# EAGLE design lsm330dl (EAGLE 7.3.0)
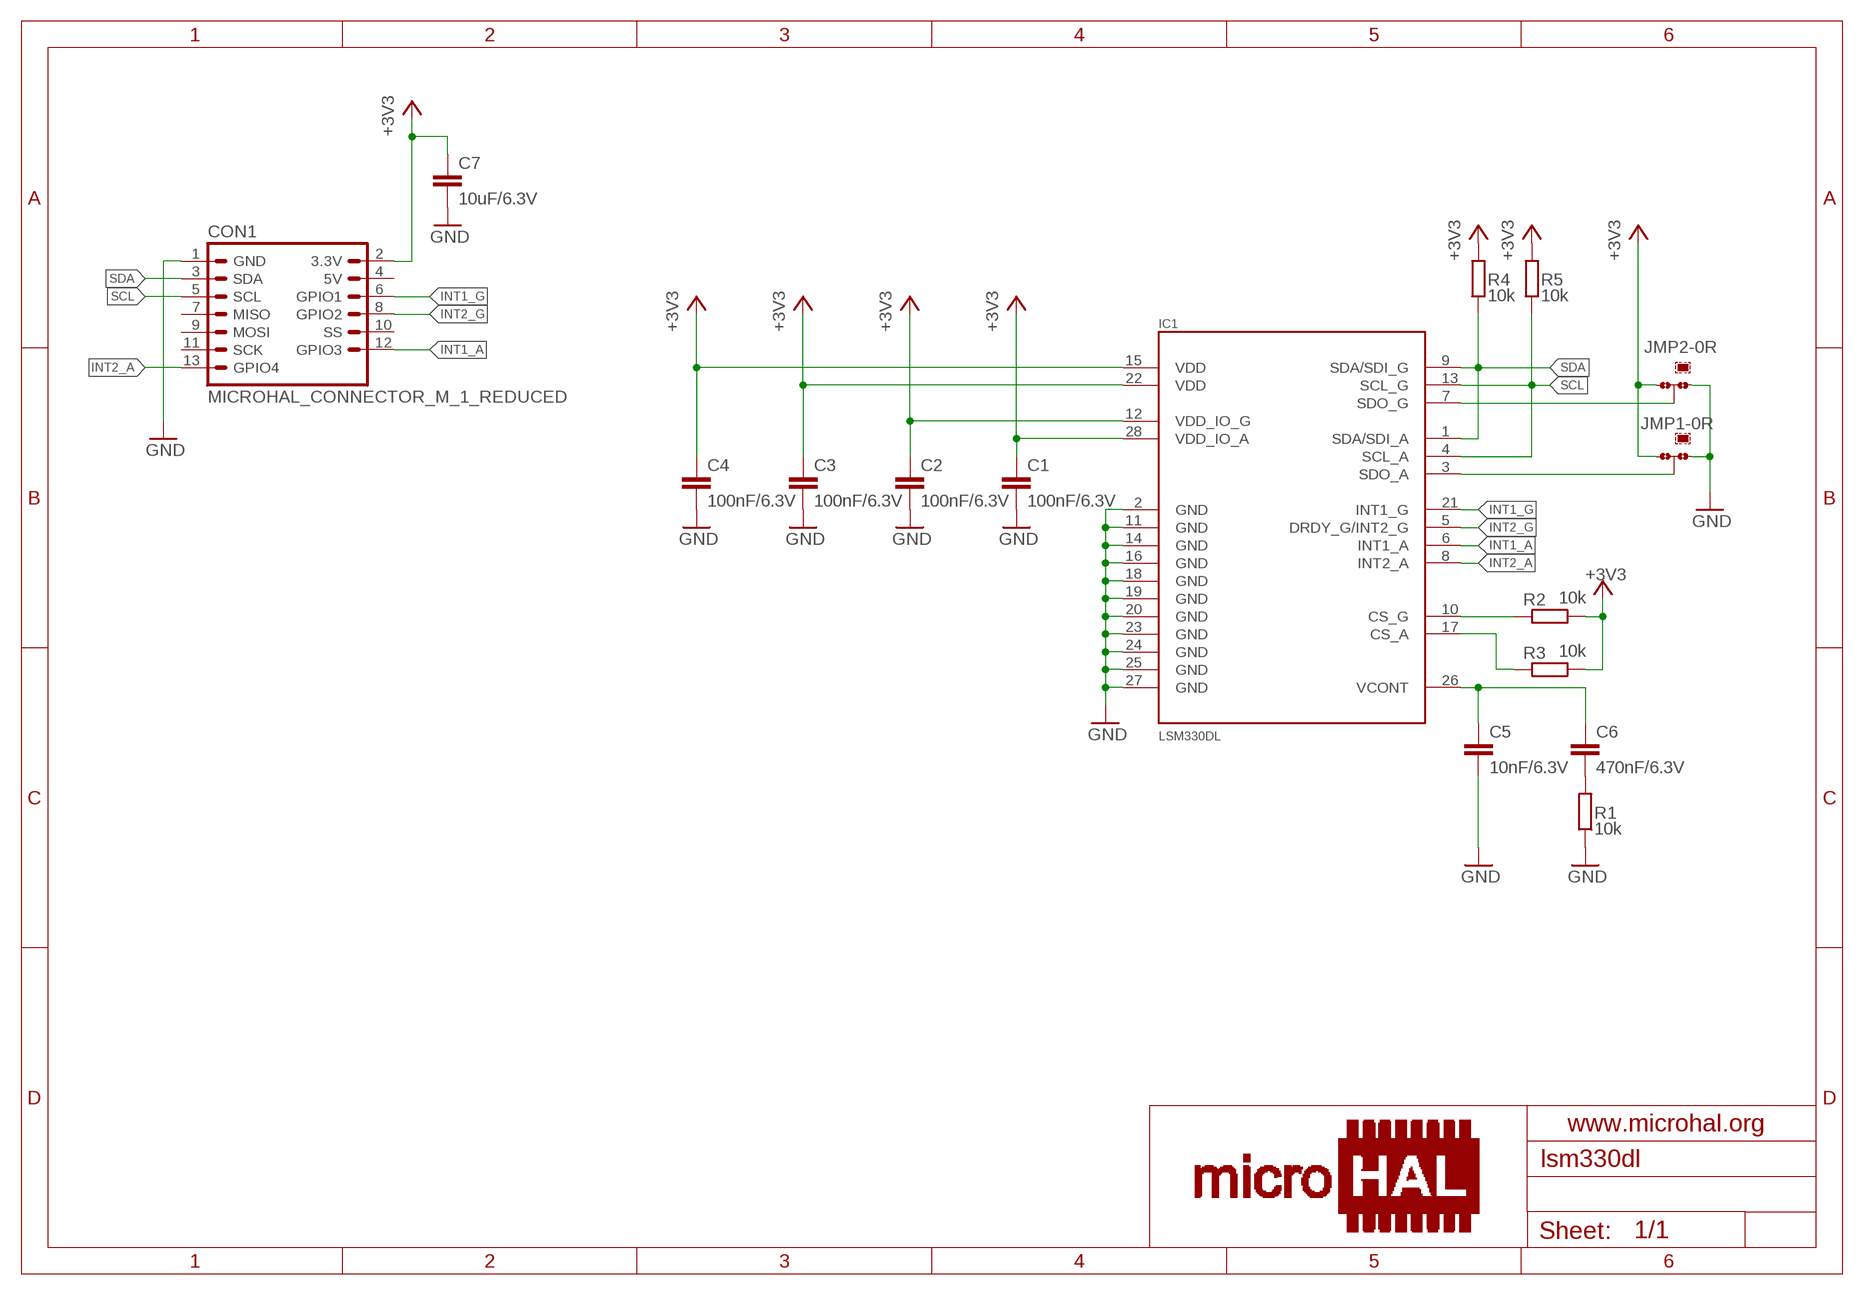
[diagram p0: schematic, sheet 1]

## Parts
C1  100nF/6.3V  C-EUC0402K  [C0402K]
C2  100nF/6.3V  C-EUC0402K  [C0402K]
C3  100nF/6.3V  C-EUC0402K  [C0402K]
C4  100nF/6.3V  C-EUC0402K  [C0402K]
C5  10nF/6.3V  C-EUC0402K  [C0402K]
C6  470nF/6.3V  C-EUC0402K  [C0402K]
C7  10uF/6.3V  C-EUC0805K  [C0805K]
CON1  MICROHAL_CONNECTOR_M_1_REDUCED  [MICROHAL_CONNECTOR_M_1_REDUCED_EDGE]
IC1  LSM330DL  [LGA7.5X4.4_28L]
JMP1  0R-JUMPC  [C0R-JMP]
JMP2  0R-JUMPC  [C0R-JMP]
R1  10k  R-EU_R0402  [R0402]
R2  10k  R-EU_R0402  [R0402]
R3  10k  R-EU_R0402  [R0402]
R4  10k  R-EU_R0402  [R0402]
R5  10k  R-EU_R0402  [R0402]

## Nets
+3V3: C1.1 C2.1 C3.1 C4.1 C7.1 CON1.2(3.3V) IC1.12(VDD_IO_G) IC1.15(VDD) IC1.22(VDD) IC1.28(VDD_IO_A) JMP1.3 JMP2.3 R2.1 R3.1 R4.2 R5.2
GND: C1.2 C2.2 C3.2 C4.2 C5.2 C7.2 CON1.1(GND) IC1.2(GND) IC1.11(GND) IC1.14(GND) IC1.16(GND) IC1.18(GND) IC1.19(GND) IC1.20(GND) IC1.23(GND) IC1.24(GND) IC1.25(GND) IC1.27(GND) JMP1.1 JMP2.1 R1.1
INT1_A: CON1.12(GPIO3) IC1.6(INT1_A)
INT1_G: CON1.6(GPIO1) IC1.21(INT1_G)
INT2_A: CON1.13(GPIO4) IC1.8(INT2_A)
INT2_G: CON1.8(GPIO2) IC1.5(DRDY_G/INT2_G)
N$1: C6.2 R1.2
N$2: C5.1 C6.1 IC1.26(VCONT)
N$3: IC1.17(CS_A) R3.2
N$4: IC1.10(CS_G) R2.2
N$6: IC1.3(SDO_A) JMP1.2
N$7: IC1.7(SDO_G) JMP2.2
SCL: CON1.5(SCL) IC1.4(SCL_A) IC1.13(SCL_G) R5.1
SDA: CON1.3(SDA) IC1.1(SDA/SDI_A) IC1.9(SDA/SDI_G) R4.1
Unconnected: CON1.4(5V) CON1.7(MISO) CON1.9(MOSI) CON1.10(SS) CON1.11(SCK)

## Library data of the parts
C1-C7 = rcl:C-EU: CAPACITOR, European symbol
CON1 = microhal-connector_v0.1:MICROHAL_CONNECTOR_M_1_REDUCED
IC1 = lsm330dl:LSM330DL
JMP1 JMP2 = jump-0r-smd:0R-JUMP: SMD 0R 0805 Jumper
R1-R5 = rcl:R-EU_: RESISTOR, European symbol

## Board
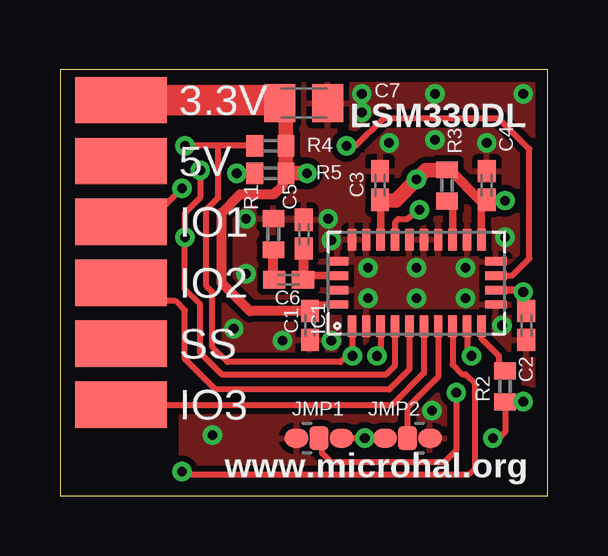
[diagram p1: board, top side]
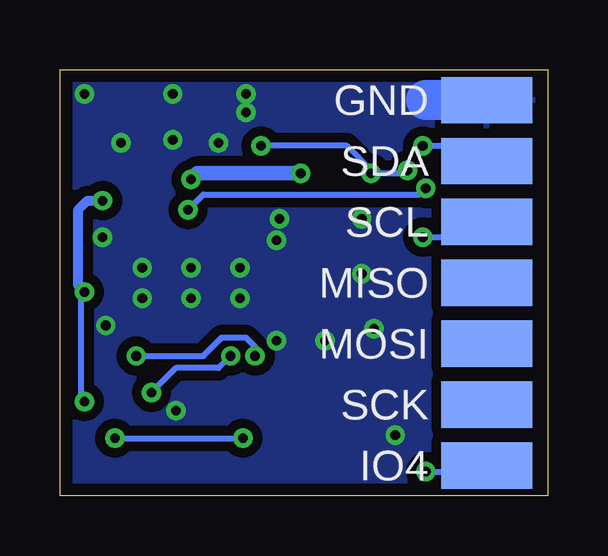
[diagram p2: board, bottom side, seen from below]

Size 20.32 x 17.78 mm. Coordinates in mm from the lower left corner, seen from the top.
Outline: 0,0 20.32,0 20.32,17.78 0,17.78 0,0
Copper layers (1*16): Top 0.035mm / dielectric 1.5mm / Bottom 0.035mm
Design rules "default *": minimum track width 10mil, minimum drill 14mil, track to track 8mil, track to pad 8mil, pad to pad 8mil, via to via 8mil, smd to smd 4mil, copper to edge 20mil, drill to drill 8mil, minimum pad ring 10mil, minimum via ring 8mil, stop-mask expansion 4mil, vias tented up to drill 16mil, thermal gap 10mil

### Footprints (pad centres in the part's own frame; a part is rotated, then mirrored left to right if it is on the bottom)
C0402K = smd 0.925 x 0.74: 1 -0.6,0; 2 0.6,0
C0805K = smd 1.3 x 1.6: 1 -1,0; 2 1,0
MICROHAL_CONNECTOR_M_1_REDUCED_EDGE = smd 1.93 x 3.81 bottom: 1 -7.62,0; 3 -5.08,0; 5 -2.54,0; 7 0,0; 9 2.54,0; 11 5.08,0; 13 7.62,0 | smd 1.93 x 3.81: 2 -7.62,0; 4 -5.08,0; 6 -2.54,0; 8 0,0; 10 2.54,0; 12 5.08,0
LGA7.5X4.4_28L = smd 0.9 x 0.35: 1 -1.8,2.7; 2 -1.8,2.1; 3 -1.8,1.5; 4 -1.8,0.9; 5 -1.8,0.3; 6 -1.8,-0.3; 7 -1.8,-0.9; 8 -1.8,-1.5; 9 -1.8,-2.1; 10 -1.8,-2.7; 15 1.8,-2.7; 16 1.8,-2.1; 17 1.8,-1.5; 18 1.8,-0.9; 19 1.8,-0.3; 20 1.8,0.3; 21 1.8,0.9; 22 1.8,1.5; 23 1.8,2.1; 24 1.8,2.7 | smd 0.35 x 0.9: 11 -0.9,-3.3; 12 -0.3,-3.3; 13 0.3,-3.3; 14 0.9,-3.3; 25 0.9,3.3; 26 0.3,3.3; 27 -0.3,3.3; 28 -0.9,3.3
C0R-JMP = smd 0.8 x 1: 1 0,0.938; 3 0,-0.938 | smd 1 x 0.8: 2 0,0
R0402 = smd 0.7 x 0.9: 1 -0.65,0; 2 0.65,0

### Placement (x,y rotation side)
C1  10.41,7.11 270 top
C2  19.43,7.11 270 top
C3  13.34,12.95 90 top
C4  17.78,12.95 90 top
C5  10.16,10.92 90 top
C6  9.53,9.02 180 top
C7  10.16,16.38 0 top
CON1  2.54,8.89 270 top
IC1  14.86,8.89 90 top
JMP1  10.79,2.41 90 top
JMP2  14.48,2.41 270 top
R1  8.89,10.92 270 top
R2  18.54,4.57 90 top
R3  16.13,12.95 270 top
R4  8.76,14.61 0 top
R5  8.76,13.46 0 top

### Tracks (layer width: path | path; a pad name or v marks a point on that pad's centre or on a via)
+3V3  (via drill 0.4)
  Top 0.254: IC1.28 10.38,7.99 C1.1 | JMP2.3 v12.7,2.41 JMP1.3 | v18.03,2.41 18.29,2.41 18.54,2.67 R2.1 19.16,3.92 v19.3,3.94
  Top 0.305: IC1.22 13.36,12.33 C3.1 | IC1.15 17.56,12.26 C4.1 | IC1.12 19.3,8.59
  Top 0.406: 17.56,12.26 17.56,12.29 16.24,13.6 R3.1 | v18.54,12.32 17.82,12.32 C4.1 | C1.1 7.91,7.71 6.73,8.89 6.73,11.81 7.49,12.57 8.89,12.57 9.27,12.95 9.27,13.32 R5.2 | C2.1 v19.3,8.51 19.3,8.59
  Top 0.61: 13.36,12.33 13.98,12.33 v14.86,13.21 15.24,13.59 16.11,13.59 R3.1 | C7.1 9.41,16.51 R4.2 R5.2 9.4,13.46 9.4,13.59 9.53,13.46 v10.29,13.46
  Top 1.27: CON1.2 9.14,16.51 9.16,16.49 C7.1
  Bottom 0.254: v18.03,2.41 v12.7,2.41 | v19.3,3.94 19.43,4.06 19.43,8.51 v19.3,8.51
  Bottom 0.406: v19.3,8.51 19.56,8.76 19.56,11.94 19.18,12.32 v18.54,12.32
  Bottom 0.61: v10.29,13.46 14.61,13.46 v14.86,13.21
GND  (via drill 0.4)
  Bottom 1.676: CON1.1 5.08,16.51
  other vias: 12.83,9.53 12.57,16.76 12.57,16 13.72,14.73 17.78,14.73 19.3,16.76 15.62,16.76 15.62,14.86 11.18,11.56 7.75,11.56 6.35,2.54 9.27,6.48 11.3,6.48 15.49,3.56 18.41,7.11 12.83,8.26 16.89,8.26 16.89,9.53 14.86,9.53 14.86,8.26 7.24,6.99 7.75,9.27 11.3,10.67 18.54,10.79
  pour Top (isolate 0.254): 5.08,17.78 20.32,17.78 20.32,0 5.08,0
  pour Bottom (isolate 0.406): 0,17.78 20.32,17.78 20.32,0 0,0
INT1_A
  Top 0.254: CON1.12 13.84,3.81 15.16,5.13 IC1.6
INT1_G  (via drill 0.4)
  Top 0.254: IC1.21 13.97,11.43 14.1,11.56 14.48,11.56 v14.99,11.94 | CON1.6 3.3,11.43 3.68,11.43 | 3.68,11.43 3.81,11.43 3.81,11.81 3.56,12.06 | v5.08,12.83 3.68,11.43
  Bottom 0.254: v14.99,11.94 14.35,12.57 5.33,12.57 v5.08,12.83
INT2_A  (via drill 0.4)
  Top 0.254: v5.08,1.02 5.21,0.89 17.02,0.89 17.27,1.14 17.27,4.7 16.89,5.08 16.76,5.08 16.36,5.49 IC1.8
  Bottom 0.254: v5.08,1.02 4.32,1.02 4.19,0.89 3.81,1.27 CON1.13
INT2_G
  Top 0.254: IC1.5 14.56,5.29 13.72,4.45 6.48,4.45 5.21,5.71 5.21,7.75 4.83,8.13 3.3,8.13 CON1.8
N$1
  Top 0.406: C6.2 8.89,9.02 R1.2
N$2
  Top 0.305: IC1.26 10.12,9.19 C6.1
  Top 0.406: C6.1 10.16,9.02 C5.1
N$3
  Top 0.305: IC1.17 16.36,12.2 R3.2
N$4
  Top 0.254: IC1.10 17.56,6.57 18.29,5.84 18.29,5.33 R2.2
N$6  (via drill 0.4)
  Top 0.254: IC1.3 13.36,5.99 v13.21,5.84 | v16.51,4.32 16.51,1.91 16,1.4 11.3,1.4 10.92,1.78 10.92,2.29 JMP1.2
  Bottom 0.254: v13.21,5.84 13.72,5.33 15.49,5.33 v16.51,4.32
N$7
  Top 0.254: IC1.7 15.76,4.96 14.48,3.68 JMP2.2
SCL  (via drill 0.4)
  Top 0.254: IC1.4 13.96,5.45 13.59,5.08 6.73,5.08 5.84,5.97 5.84,8 5.21,8.64 v5.21,10.79 5.21,11.81 5.84,12.45 v5.84,13.59 | R5.1 v7.37,13.46 | IC1.13 18.84,9.19 19.56,9.91 19.56,14.48 18.29,15.75 13.46,15.75 12.32,14.61 v11.94,14.61
  Bottom 0.254: v5.21,10.79 3.17,10.79 CON1.5 | v5.84,13.59 5.84,13.46 v7.37,13.46 7.37,13.59 8.38,14.61 v11.94,14.61
SDA  (via drill 0.4)
  Top 0.254: IC1.9 16.96,5.9 v17.14,5.84 | IC1.1 12.19,7.06 v12.19,5.84 11.94,5.84 11.68,5.59 6.99,5.59 6.35,6.22 6.35,8.51 6.1,8.76 6.1,11.94 6.6,12.45 6.6,14.61 | R4.1 6.6,14.61 | 6.6,14.61 v5.21,14.61
  Bottom 0.254: v17.14,5.84 14.35,5.84 13.59,6.6 12.57,6.6 12.19,6.22 v12.19,5.84 | 3.68,13.46 CON1.3 arc-90 3.17,14.61 v5.21,14.61

### Text on the board
tPlace: LSM330DL | www.microhal.org